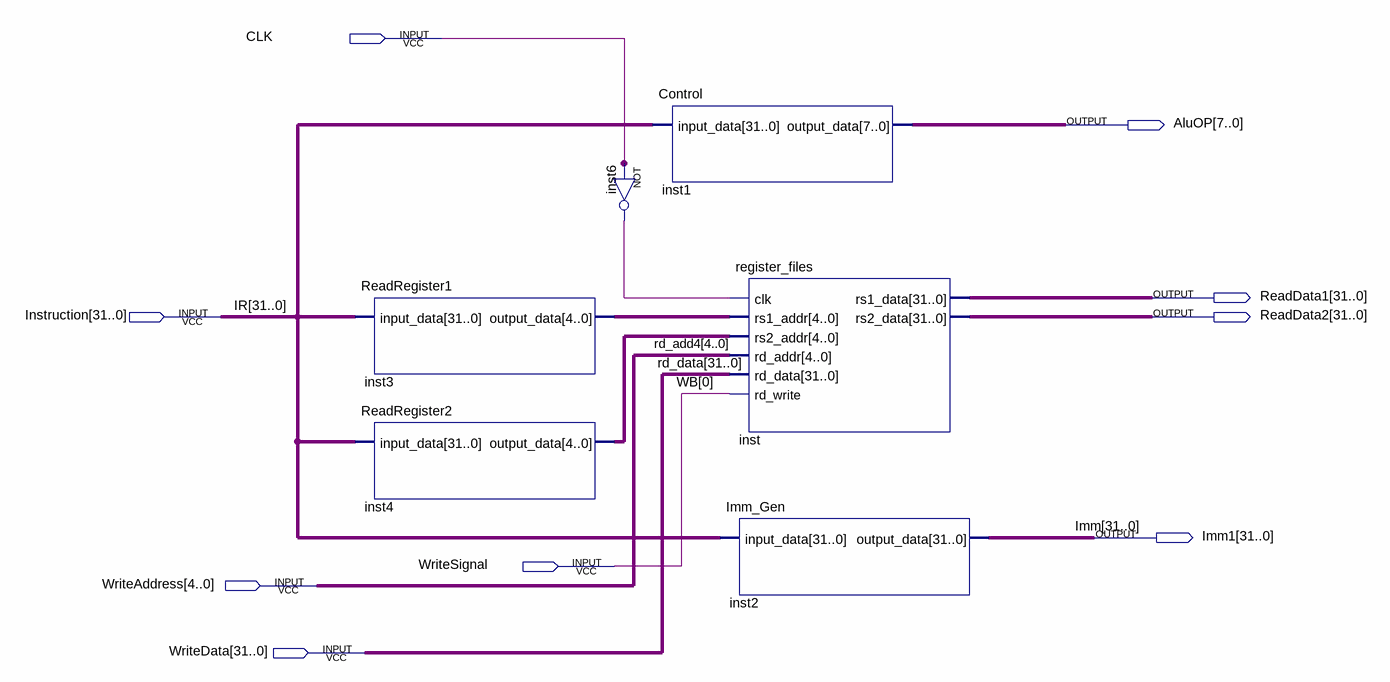
[diagram p0: schematic sheet]
// Quartus schematic ID.bdf as structural Verilog: 6 symbols, 9 pins
module ID (
  input  CLK,
  input  [31:0] Instruction,
  input  WriteSignal,
  input  [4:0] WriteAddress,
  input  [31:0] WriteData,
  output [7:0] AluOP,
  output [31:0] ReadData1,
  output [31:0] ReadData2,
  output [31:0] Imm1
);

  wire inst6_out;
  wire [4:0] inst3_output_data, inst4_output_data;

  ReadRegister1 inst3 (.input_data(Instruction), .output_data(inst3_output_data));
  ReadRegister2 inst4 (.input_data(Instruction), .output_data(inst4_output_data));
  not inst6 (inst6_out, CLK);
  Control inst1 (.input_data(Instruction), .output_data(AluOP));
  register_files inst (
    .clk(inst6_out), .rs1_addr(inst3_output_data), .rs2_addr(inst4_output_data), .rd_addr(WriteAddress),
    .rd_data(WriteData), .rd_write(WriteSignal), .rs1_data(ReadData1), .rs2_data(ReadData2));
  Imm_Gen inst2 (.input_data(Instruction), .output_data(Imm1));

  // Other names for the same wires on the sheet: Imm[31:0] = Imm1; IR[31:0] = Instruction;
  //   rd_add4[4:0] = WriteAddress; rd_data[31:0] = WriteData; WB[0] = WriteSignal
endmodule
